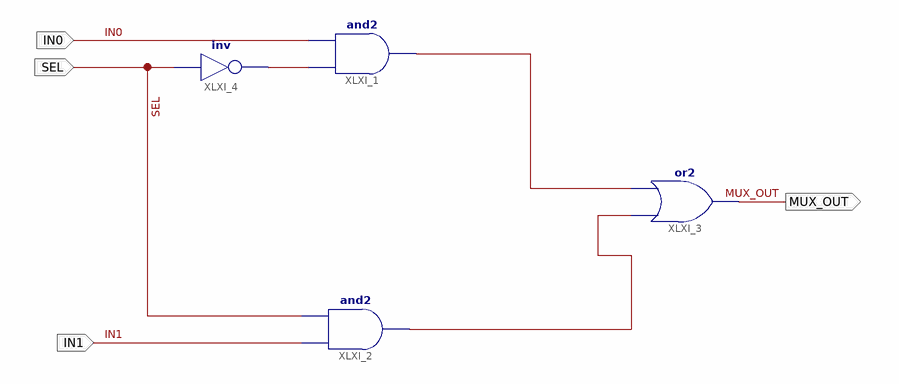
[diagram p0: schematic sheet 1]
// Xilinx ISE schematic mux.sch (spartan3e) as structural Verilog: 4 symbols, 4 ports
module mux (
  input  SEL,
  input  IN1,
  input  IN0,
  output MUX_OUT
);

  wire XLXN_2, XLXN_7, XLXN_13;

  and XLXI_1 (XLXN_7, XLXN_2, IN0);
  and XLXI_2 (XLXN_13, IN1, SEL);
  or XLXI_3 (MUX_OUT, XLXN_13, XLXN_7);
  not XLXI_4 (XLXN_2, SEL);
endmodule
